# Altium schematic sheet DWM1000Breakout.SchDoc: DecaWave DWM1000 RPI Breakout
size A4; CompanyName: WiSE Lab; Engineer: Anh Luong; Organization: Carnegie Mellon University; Address1: 4720 Forbes Ave; Address2: CIC 2219F; Address3: Pittsburgh, PA 15213; Address4: USA; Revision: 1; SheetNumber: 1; SheetTotal: 1
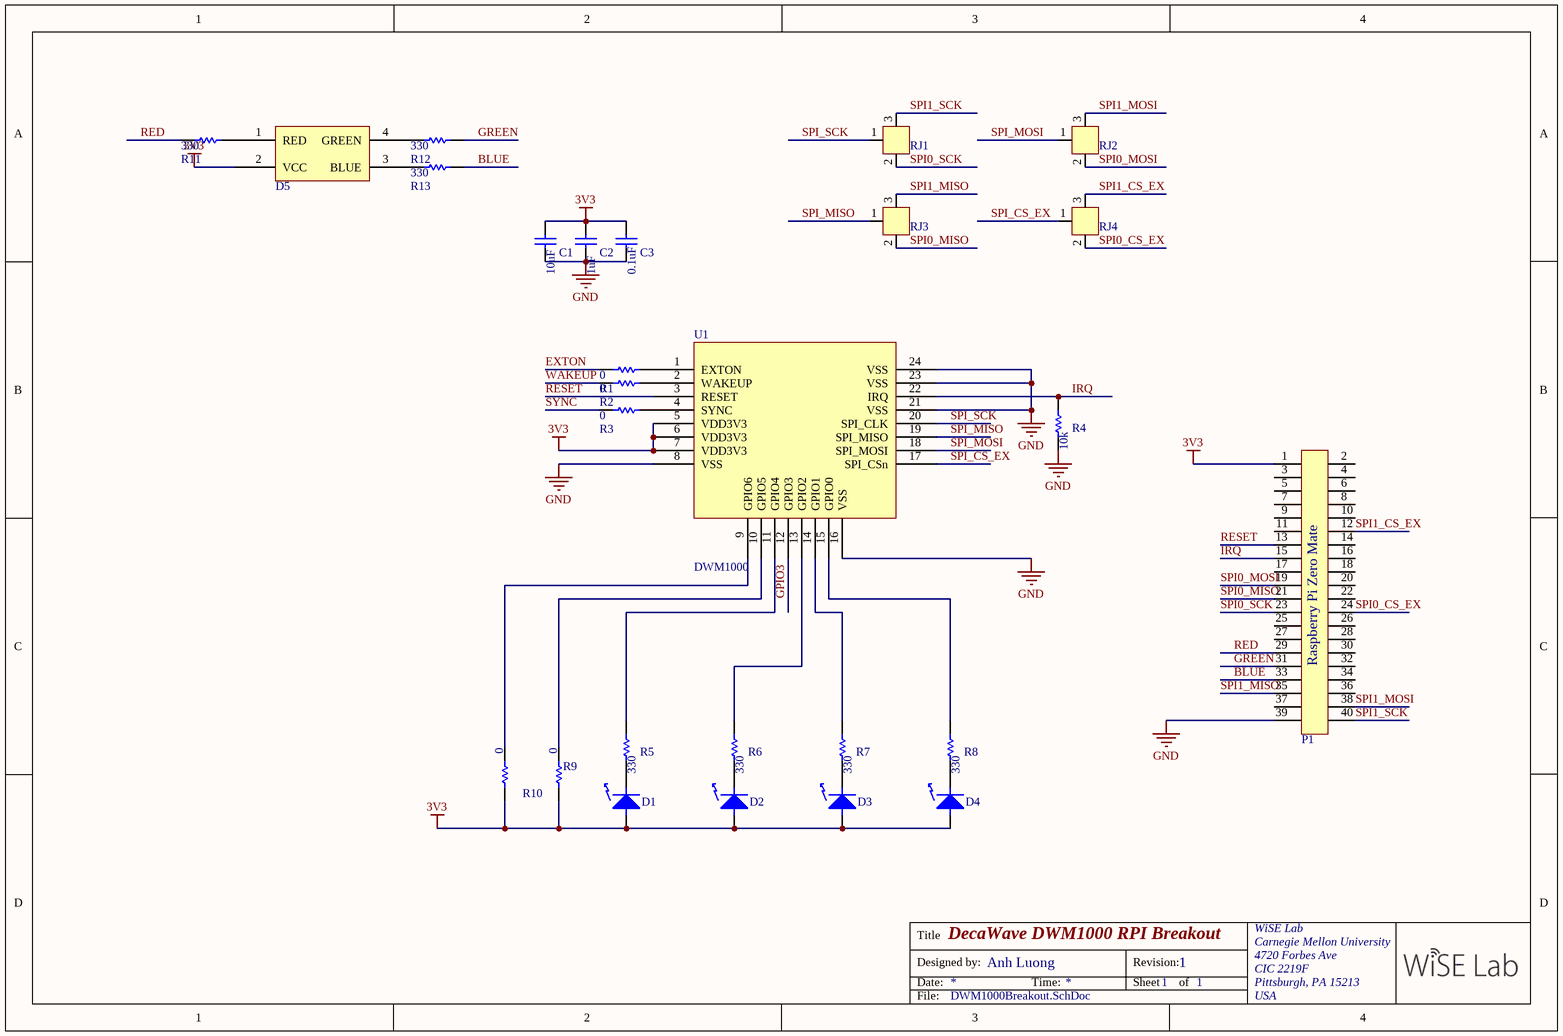
[diagram p0: DWM1000Breakout.SchDoc]

## Parts
C1  GRM188R60J106ME47D  [CAPC1608X08N (0603)]  (value not drawn)
C2  GRM188R61A105KA61D  [CAPC1608X08N (0603)]  (value not drawn)
C3  GRM188R71C104KA01D  [CAPC1608X08N (0603)]  (value not drawn)
D1  LG Q971-KN-1  [CHIPLED0603]  (value not drawn)
D2  LG Q971-KN-1  [CHIPLED0603]  (value not drawn)
D3  LG Q971-KN-1  [CHIPLED0603]  (value not drawn)
D4  LG Q971-KN-1  [CHIPLED0603]  (value not drawn)
D5  CLV1A-FKB-CJ1M1F1BB7R4S3  [CREE LV1]  (value not drawn)
P1  Raspbery Pi Zero Mate  [Raspberry Pi Zero]  (value not drawn)
R1  MCR03ERTJ000  [RESC1608X06N (0603)]  (value not drawn)
R2  MCR03ERTJ000  [RESC1608X06N (0603)]  (value not drawn)
R3  MCR03ERTJ000  [RESC1608X06N (0603)]  (value not drawn)
R4  MCR03ERTJ103  [RESC1608X06N (0603)]  (value not drawn)
R5  MCR03ERTJ331  [RESC1608X06N (0603)]  (value not drawn)
R6  MCR03ERTJ331  [RESC1608X06N (0603)]  (value not drawn)
R7  MCR03ERTJ331  [RESC1608X06N (0603)]  (value not drawn)
R8  MCR03ERTJ331  [RESC1608X06N (0603)]  (value not drawn)
R9  MCR03ERTJ000  [RESC1608X06N (0603)]  (value not drawn)
R10  MCR03ERTJ000  [RESC1608X06N (0603)]  (value not drawn)
R11  MCR03ERTJ331  [RESC1608X06N (0603)]  (value not drawn)
R12  MCR03ERTJ331  [RESC1608X06N (0603)]  (value not drawn)
R13  MCR03ERTJ331  [RESC1608X06N (0603)]  (value not drawn)
RJ1  R_J  [RJ]  (value not drawn)
RJ2  R_J  [RJ]  (value not drawn)
RJ3  R_J  [RJ]  (value not drawn)
RJ4  R_J  [RJ]  (value not drawn)
U1  DWM1000  [DWM1000]

## Nets
3V3: C1.2 C2.2 C3.2 D1.1 D2.1 D3.1 D4.1 D5.2(VCC) P1.1 R9.2 R10.2 U1.5(VDD3V3) U1.6(VDD3V3) U1.7(VDD3V3)
GND: C1.1 C2.1 C3.1 P1.39 R4.1 U1.8(VSS) U1.16(VSS) U1.21(VSS) U1.23(VSS) U1.24(VSS)
BLUE: P1.33 R13.2
EXTON: R1.1
GPIO3: U1.12(GPIO3)
GREEN: P1.31 R12.2
IRQ: P1.15 R4.2 U1.22(IRQ)
RED: P1.29 R11.1
RESET: P1.13 U1.3(RESET)
SPI0_CS_EX: P1.24 RJ4.2
SPI0_MISO: P1.21 RJ3.2
SPI0_MOSI: P1.19 RJ2.2
SPI0_SCK: P1.23 RJ1.2
SPI1_CS_EX: P1.12 RJ4.3
SPI1_MISO: P1.35 RJ3.3
SPI1_MOSI: P1.38 RJ2.3
SPI1_SCK: P1.40 RJ1.3
SPI_CS_EX: RJ4.1 U1.17(SPI_CSn)
SPI_MISO: RJ3.1 U1.19(SPI_MISO)
SPI_MOSI: RJ2.1 U1.18(SPI_MOSI)
SPI_SCK: RJ1.1 U1.20(SPI_CLK)
SYNC: R3.1
WAKEUP: R2.1
NetD1_2: D1.2 R5.1
NetD2_2: D2.2 R6.1
NetD3_2: D3.2 R7.1
NetD4_2: D4.2 R8.1
NetD5_1: D5.1(RED) R11.2
NetD5_3: D5.3(BLUE) R13.1
NetD5_4: D5.4(GREEN) R12.1
NetR1_2: R1.2 U1.1(EXTON)
NetR2_2: R2.2 U1.2(WAKEUP)
NetR3_2: R3.2 U1.4(SYNC)
NetR5_2: R5.2 U1.11(GPIO4)
NetR6_2: R6.2 U1.13(GPIO2)
NetR7_2: R7.2 U1.14(GPIO1)
NetR8_2: R8.2 U1.15(GPIO0)
NetR9_1: R9.1 U1.10(GPIO5)
NetR10_1: R10.1 U1.9(GPIO6)

Not connected (* = marked no-connect by the designer): P1 2 3 4 5 6 7 8 9 10 11 14 16 17 18 20 22 25 26 27 28 30 32 34 36 37

## Notes on the sheet
- Title
- Designed by:
- Date:
- Time:
- Revision:
- Sheet
- of
- File:
- (in symbol GRM188R60J106ME47D) 10uF
- (in symbol GRM188R61A105KA61D) 1uF
- (in symbol GRM188R71C104KA01D) 0.1uF
- (in symbol MCR03ERTJ000) 0

## Library data of the parts
C1 = GRM188R60J106ME47D: CAP CER 10UF 6.3V 20% X5R 0603; Manufacturer: Murata Electronics North America; Capacitance: 10µF; Supplier 1: Digi-Key; Manufacturer Part Number: GRM188R60J106ME47D; RoHS: RoHS Compliant; Category: Capacitors; Stock 1: 2128324; Pricing 1: 1=0.24, 10=0.2, 50=0.1126, 100=0.1, 250=0.075, 500=0.06626, 1000=0.05875 (USD); Packaging: Digi-Reel®; Voltage - Rated: 6.3V; Tolerance: ±20%; Temperature Coefficient: X5R; Mounting Type: Surface Mount, MLCC; Operating Temperature: -55°C ~ 85°C; Applications: General Purpose; Ratings: -; Package / Case: 0603 (1608 Metric); Size / Dimension: 0.063" L x 0.031" W (1.60mm x 0.80mm); Height - Seated (Max): -; Thickness (Max): 0.035" (0.90mm); Lead Spacing: -; Features: -; Lead Style: -; ComponentLink1URL: http://search.murata.co.jp/Ceramy/image/img/A01X/G101/ENG/GRM188R60J106ME47-01.pdf; ComponentLink1Description: http://search.murata.co.jp/Ceramy/image/img/A01X/G101/ENG/GRM188R60J106ME47-01.pdf; Supplier 2: Digi-Key
C2 = GRM188R61A105KA61D: CAP CER 1UF 10V 10% X5R 0603; Manufacturer: Murata Electronics North America; Capacitance: 1.0µF; Supplier 1: Digi-Key; Manufacturer Part Number: GRM188R61A105KA61D; RoHS: RoHS Compliant; Category: Capacitors; Stock 1: 244919; Pricing 1: 1=0.1, 10=0.041, 50=0.0224, 100=0.019, 250=0.01552, 500=0.01328, 1000=0.01035 (USD); Packaging: Cut Tape (CT); Voltage - Rated: 10V; Tolerance: ±10%; Temperature Coefficient: X5R; Mounting Type: Surface Mount, MLCC; Operating Temperature: -55°C ~ 85°C; Applications: General Purpose; Ratings: -; Package / Case: 0603 (1608 Metric); Size / Dimension: 0.063" L x 0.031" W (1.60mm x 0.80mm); Height - Seated (Max): -; Thickness (Max): 0.035" (0.90mm); Lead Spacing: -; Features: -; Lead Style: -; ComponentLink1URL: http://search.murata.co.jp/Ceramy/image/img/A01X/G101/ENG/GRM188R61A105KA61-01.pdf; ComponentLink1Description: http://search.murata.co.jp/Ceramy/image/img/A01X/G101/ENG/GRM188R61A105KA61-01.pdf
C3 = GRM188R71C104KA01D: CAP CER 0.1UF 16V 10% X7R 0603; Manufacturer: Murata Electronics North America; Capacitance: 0.1µF; Supplier 1: Digi-Key; Manufacturer Part Number: GRM188R71C104KA01D; RoHS: RoHS Compliant; Category: Capacitors; Stock 1: 1458181; Pricing 1: 1=0.1, 10=0.019, 50=0.0102, 100=0.0086, 250=0.00704, 500=0.006, 1000=0.00468 (USD); Packaging: Cut Tape (CT); Tolerance: ±10%; Voltage - Rated: 16V; Temperature Coefficient: X7R; Mounting Type: Surface Mount, MLCC; Operating Temperature: -55°C ~ 125°C; Applications: General Purpose; Ratings: -; Package / Case: 0603 (1608 Metric); Size / Dimension: 0.063" L x 0.031" W (1.60mm x 0.80mm); Height - Seated (Max): -; Thickness (Max): 0.035" (0.90mm); Lead Spacing: -; Features: -; Lead Style: -; ComponentLink1URL: http://search.murata.co.jp/Ceramy/image/img/A01X/G101/ENG/GRM188R71C104KA01-01.pdf; ComponentLink1Description: http://search.murata.co.jp/Ceramy/image/img/A01X/G101/ENG/GRM188R71C104KA01-01.pdf
D1-D4 = LG Q971-KN-1: LED CHIPLED 570NM GREEN 0603 SMD; Manufacturer: OSRAM Opto Semiconductors Inc; Wavelength - Peak: 572nm; Millicandela Rating: 10mcd; Voltage - Forward (Vf) Typ: 2.2V; Current - Test: 20mA; Viewing Angle: 160°; Lens Type: Diffused; Lens Style/Size: Rectangle with Flat Top, 1mm x 0.8mm; Supplier 1: Digi-Key; Manufacturer Part Number: LG Q971-KN-1; RoHS: RoHS Compliant; Category: Optoelectronics; Stock 1: 44000; Pricing 1: 4000=0.03632 (USD); Packaging: Tape & Reel (TR); Color: Green; Wavelength - Dominant: 570nm; Package / Case: 0603 (1608 Metric); Size / Dimension: 1.60mm L x 0.80mm W; Height: 0.80mm; Mounting Type: Surface Mount; Luminous Flux @ Current - Test: -; ComponentLink1URL: http://catalog.osram-os.com/catalogue/catalogue.do;jsessionid=DE4D071D0D2758CC117C711BF848053E?act=downloadFile&favOid=0200000600005069000100b6; ComponentLink1Description: http://catalog.osram-os.com/catalogue/catalogue.do;jsessionid=DE4D071D0D2758CC117C711BF848053E?act=downloadFile&favOid=0200000600005069000100b6
D5 = CLV1A-FKB-CJ1M1F1BB7R4S3: LED RED/GREEN/BLUE PLCC4 SMD; Manufacturer: Cree Inc; Color: Red, Green, Blue (RGB); Wavelength - Dominant: 621.5nm, 530nm, 472.5nm; Wavelength - Peak: 630nm, 527nm, 470nm; Millicandela Rating: 675mcd Red, 1055mcd Green, 337mcd Blue; Voltage - Forward (Vf) (Typ): 2V Red, 3.2V Green, 3.2V Blue; Current - Test: 20mA; Viewing Angle: 120°; Lens Type: Diffused, White; Lens Style/Size: Round with Flat Top, 2.2mm; Supplier 1: Digi-Key; Manufacturer Part Number: CLV1A-FKB-CJ1M1F1BB7R4S3; RoHS: RoHS Compliant; Category: Optoelectronics; Stock 1: 254000; Pricing 1: 2000=0.354, 50000=0.329, 100000=0.307 (USD); Packaging: Tape & Reel (TR); Package / Case: 4-PLCC; Size / Dimension: 3.20mm L x 2.80mm W; Height: 2.10mm; Mounting Type: Surface Mount; Luminous Flux @ Current - Test: -; ComponentLink1URL: http://www.cree.com/~/media/Files/Cree/LED%20Components%20and%20Modules/HB/Data%20Sheets/CLV1AFKB(874).pdf; ComponentLink1Description: http://www.cree.com/~/media/Files/Cree/LED%20Components%20and%20Modules/HB/Data%20Sheets/CLV1AFKB(874).pdf
P1 = Raspberry Pi Zero Mate: The header and mechanical drawings for connnecting a Raspbery Pi Zero
R1-R3 R9 R10 = MCR03ERTJ000: RES 0.0 OHM 1/10W JUMP 0603 SMD; Manufacturer: Rohm Semiconductor; Resistance (Ohms): 0.0; Tolerance: Jumper; Power (Watts): 0.1W, 1/10W; Supplier 1: Digi-Key; Manufacturer Part Number: MCR03ERTJ000; RoHS: RoHS Compliant; Category: Resistors; Stock 1: 127296; Pricing 1: 1=0.1, 25=0.0064, 100=0.0035, 250=0.00268, 500=0.00214, 1000=0.00157 (USD); Packaging: Cut Tape (CT); Composition: Thick Film; Features: -; Temperature Coefficient: -; Package / Case: 0603 (1608 Metric); Supplier Device Package: 0603 (1608 Metric); Size / Dimension: 0.063" L x 0.031" W (1.60mm x 0.80mm); Height: 0.022" (0.55mm); Number of Terminations: 2; ComponentLink1URL: http://rohmfs.rohm.com/en/products/databook/datasheet/passive/resistor/chip_resistor/mcr_g.pdf; ComponentLink1Description: http://rohmfs.rohm.com/en/products/databook/datasheet/passive/resistor/chip_resistor/mcr_g.pdf
R4 = MCR03ERTJ103: RES 10K OHM 1/10W 5% 0603 SMD; Manufacturer: Rohm Semiconductor; Power (Watts): 0.1W, 1/10W; Temperature Coefficient: ±200ppm/°C; Supplier 1: Digi-Key; Manufacturer Part Number: MCR03ERTJ103; RoHS: RoHS Compliant; Category: Resistors; Stock 1: 330000; Pricing 1: 5000=0.00103, 10000=0.00089, 25000=0.00078, 50000=0.00072, 125000=0.0007 (USD); Packaging: Tape & Reel (TR); Resistance (Ohms): 10k; Tolerance: ±5%; Composition: Thick Film; Features: -; Package / Case: 0603 (1608 Metric); Supplier Device Package: 0603 (1608 Metric); Size / Dimension: 0.063" L x 0.031" W (1.60mm x 0.80mm); Height: 0.022" (0.55mm); Number of Terminations: 2; ComponentLink1URL: http://rohmfs.rohm.com/en/products/databook/datasheet/passive/resistor/chip_resistor/mcr_g.pdf; ComponentLink1Description: http://rohmfs.rohm.com/en/products/databook/datasheet/passive/resistor/chip_resistor/mcr_g.pdf
R5-R8 R11-R13 = MCR03ERTJ331: RES 330 OHM 1/10W 5% 0603 SMD; Manufacturer: Rohm Semiconductor; Resistance (Ohms): 330; Power (Watts): 0.1W, 1/10W; Temperature Coefficient: ±200ppm/°C; Supplier 1: Digi-Key; Manufacturer Part Number: MCR03ERTJ331; RoHS: RoHS Compliant; Category: Resistors; Stock 1: 12878; Pricing 1: 1=0.1, 10=0.013, 25=0.0092, 100=0.0052, 250=0.00396, 500=0.00316, 1000=0.00233 (USD); Packaging: Digi-Reel®; Tolerance: ±5%; Composition: Thick Film; Features: -; Package / Case: 0603 (1608 Metric); Supplier Device Package: 0603 (1608 Metric); Size / Dimension: 0.063" L x 0.031" W (1.60mm x 0.80mm); Height: 0.022" (0.55mm); Number of Terminations: 2; ComponentLink1URL: http://rohmfs.rohm.com/en/products/databook/datasheet/passive/resistor/chip_resistor/mcr_g.pdf; ComponentLink1Description: http://rohmfs.rohm.com/en/products/databook/datasheet/passive/resistor/chip_resistor/mcr_g.pdf
RJ1-RJ4 = R_J: Resistor Jumper; Value: DNP; Mounting Type: Surface Mount, MLCC; Applications: General Purpose; Package / Case: 0603 (1608 Metric)
U1 = DWM1000: MOD IEEE802.15.4-2011 UWB TXRX; Manufacturer: Decawave Limited; Frequency: 3.5GHz ~ 6.5GHz; Data Rate: 6.8Mbps; Serial Interfaces: SPI; Antenna Type: Integrated, Chip; Voltage - Supply: 2.8 V ~ 3.6 V; Current - Receiving: 64mA; Current - Transmitting: 31mA; Supplier 1: Digi-Key; Manufacturer Part Number: DWM1000; RoHS: RoHS Compliant; Category: RF/IF and RFID; Stock 1: 1028; Pricing 1: 1=32.16, 10=26.704, 100=24.24, 250=22.51296 (USD); Packaging: Cut Tape (CT); RF Family/Standard: 802.15.4; Protocol: -; Modulation: -; Power - Output: -; Sensitivity: -; Memory Size: -; Mounting Type: Surface Mount; Operating Temperature: -40°C ~ 85°C; Package / Case: Module; ComponentLink1URL: http://www.decawave.com/sites/default/files/product-pdf/dwm1000-product-brief.pdf; ComponentLink1Description: http://www.decawave.com/sites/default/files/product-pdf/dwm1000-product-brief.pdf; Supplier Part Number 1: 1479-1002-1-ND